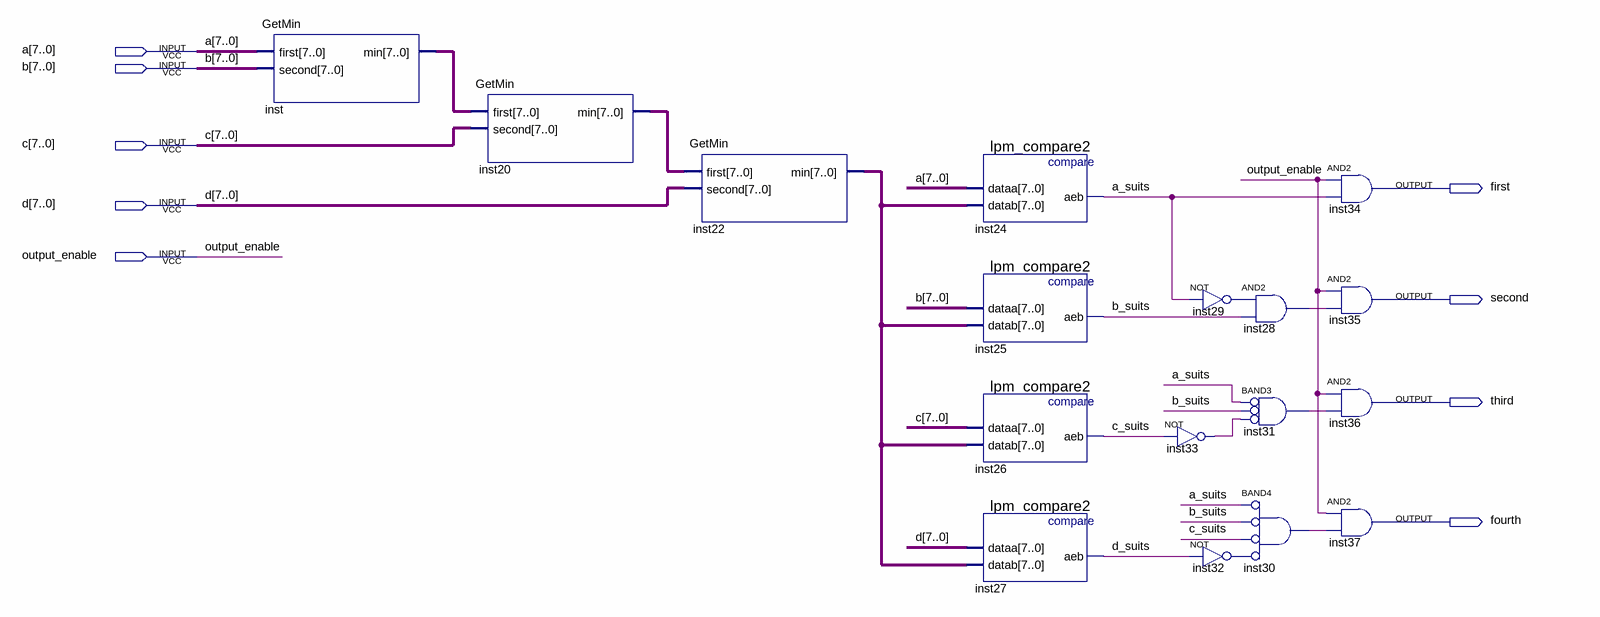
[diagram p0: schematic sheet]
// Quartus schematic FindMin.bdf as structural Verilog: 17 symbols, 9 pins
module FindMin (
  input  [7:0] a,
  input  [7:0] b,
  input  [7:0] c,
  input  [7:0] d,
  input  output_enable,
  output first,
  output second,
  output third,
  output fourth
);

  wire a_suits, b_suits, c_suits, d_suits, inst28_out, inst29_out, inst30_out, inst31_out, inst32_out,
       inst33_out;
  wire [7:0] inst20_min, inst22_min, inst_min;

  GetMin inst (.first(a), .second(b), .min(inst_min));
  GetMin inst20 (.first(inst_min), .second(c), .min(inst20_min));
  GetMin inst22 (.first(inst20_min), .second(d), .min(inst22_min));
  lpm_compare2 inst24 (.dataa(a), .datab(inst22_min), .aeb(a_suits));
  lpm_compare2 inst25 (.dataa(b), .datab(inst22_min), .aeb(b_suits));
  lpm_compare2 inst26 (.dataa(c), .datab(inst22_min), .aeb(c_suits));
  lpm_compare2 inst27 (.dataa(d), .datab(inst22_min), .aeb(d_suits));
  not inst29 (inst29_out, a_suits);
  not inst33 (inst33_out, c_suits);
  not inst32 (inst32_out, d_suits);
  and inst28 (inst28_out, inst29_out, b_suits);
  and inst31 (inst31_out, ~a_suits, ~b_suits, ~inst33_out);  // BAND3
  and inst30 (inst30_out, ~a_suits, ~b_suits, ~c_suits, ~inst32_out);  // BAND4
  and inst34 (first, output_enable, a_suits);
  and inst35 (second, output_enable, inst28_out);
  and inst36 (third, output_enable, inst31_out);
  and inst37 (fourth, output_enable, inst30_out);
endmodule
